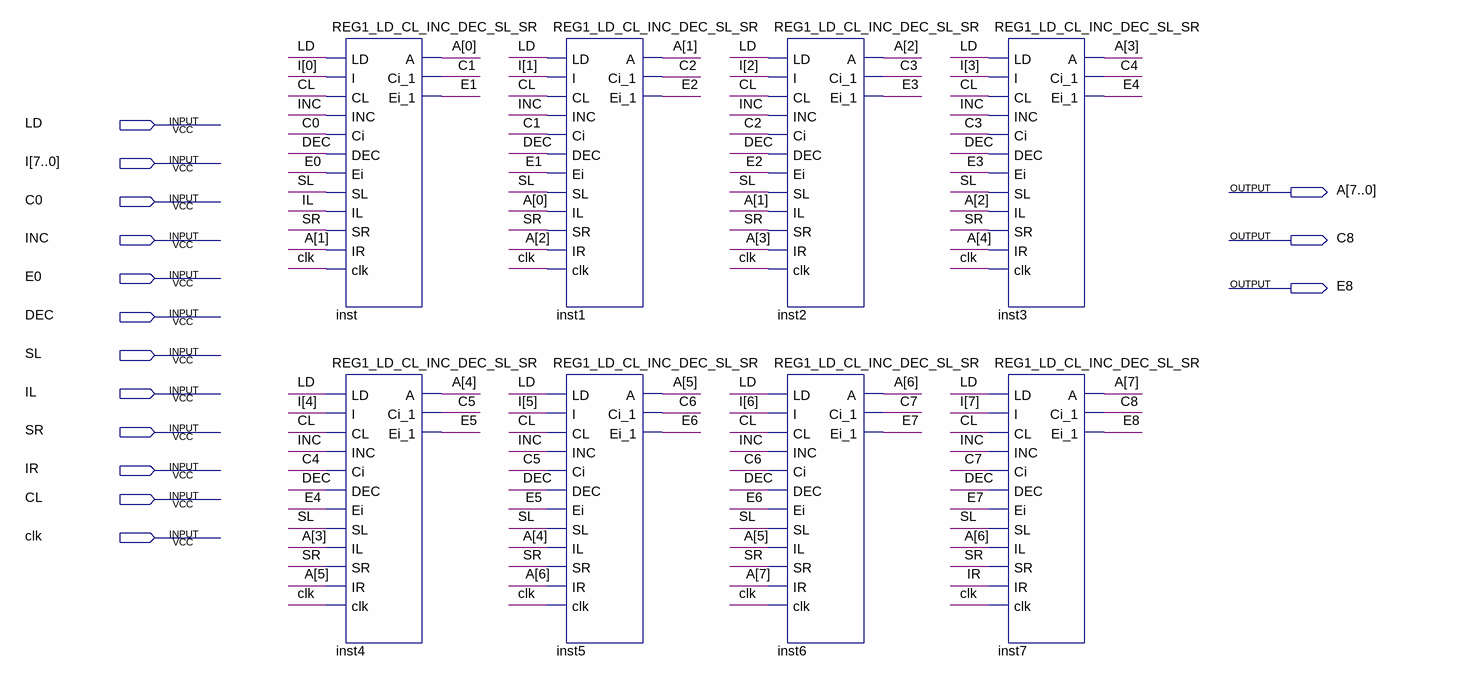
[diagram p0: schematic sheet]
// Quartus schematic REG8_LD_CL_INC_DEC_SL_SR.bdf as structural Verilog: 8 symbols, 15 pins
module REG8_LD_CL_INC_DEC_SL_SR (
  input  LD,
  input  [7:0] I,
  input  C0,
  input  INC,
  input  E0,
  input  DEC,
  input  SL,
  input  IL,
  input  SR,
  input  IR,
  input  CL,
  input  clk,
  output [7:0] A,
  output C8,
  output E8
);

  wire C1, C2, C3, C4, C5, C6, C7, E1, E2, E3, E4, E5, E6, E7;

  REG1_LD_CL_INC_DEC_SL_SR inst (
    .LD(LD), .I(I[0]), .CL(CL), .INC(INC), .Ci(C0), .DEC(DEC), .Ei(E0), .SL(SL), .IL(IL), .SR(SR), .IR(A[1]),
    .clk(clk), .A(A[0]), .Ci_1(C1), .Ei_1(E1));
  REG1_LD_CL_INC_DEC_SL_SR inst4 (
    .LD(LD), .I(I[4]), .CL(CL), .INC(INC), .Ci(C4), .DEC(DEC), .Ei(E4), .SL(SL), .IL(A[3]), .SR(SR),
    .IR(A[5]), .clk(clk), .A(A[4]), .Ci_1(C5), .Ei_1(E5));
  REG1_LD_CL_INC_DEC_SL_SR inst1 (
    .LD(LD), .I(I[1]), .CL(CL), .INC(INC), .Ci(C1), .DEC(DEC), .Ei(E1), .SL(SL), .IL(A[0]), .SR(SR),
    .IR(A[2]), .clk(clk), .A(A[1]), .Ci_1(C2), .Ei_1(E2));
  REG1_LD_CL_INC_DEC_SL_SR inst5 (
    .LD(LD), .I(I[5]), .CL(CL), .INC(INC), .Ci(C5), .DEC(DEC), .Ei(E5), .SL(SL), .IL(A[4]), .SR(SR),
    .IR(A[6]), .clk(clk), .A(A[5]), .Ci_1(C6), .Ei_1(E6));
  REG1_LD_CL_INC_DEC_SL_SR inst2 (
    .LD(LD), .I(I[2]), .CL(CL), .INC(INC), .Ci(C2), .DEC(DEC), .Ei(E2), .SL(SL), .IL(A[1]), .SR(SR),
    .IR(A[3]), .clk(clk), .A(A[2]), .Ci_1(C3), .Ei_1(E3));
  REG1_LD_CL_INC_DEC_SL_SR inst6 (
    .LD(LD), .I(I[6]), .CL(CL), .INC(INC), .Ci(C6), .DEC(DEC), .Ei(E6), .SL(SL), .IL(A[5]), .SR(SR),
    .IR(A[7]), .clk(clk), .A(A[6]), .Ci_1(C7), .Ei_1(E7));
  REG1_LD_CL_INC_DEC_SL_SR inst3 (
    .LD(LD), .I(I[3]), .CL(CL), .INC(INC), .Ci(C3), .DEC(DEC), .Ei(E3), .SL(SL), .IL(A[2]), .SR(SR),
    .IR(A[4]), .clk(clk), .A(A[3]), .Ci_1(C4), .Ei_1(E4));
  REG1_LD_CL_INC_DEC_SL_SR inst7 (
    .LD(LD), .I(I[7]), .CL(CL), .INC(INC), .Ci(C7), .DEC(DEC), .Ei(E7), .SL(SL), .IL(A[6]), .SR(SR), .IR(IR),
    .clk(clk), .A(A[7]), .Ci_1(C8), .Ei_1(E8));
endmodule
